# EAGLE design bluetooth_reprap2 (EAGLE 7.4.0)
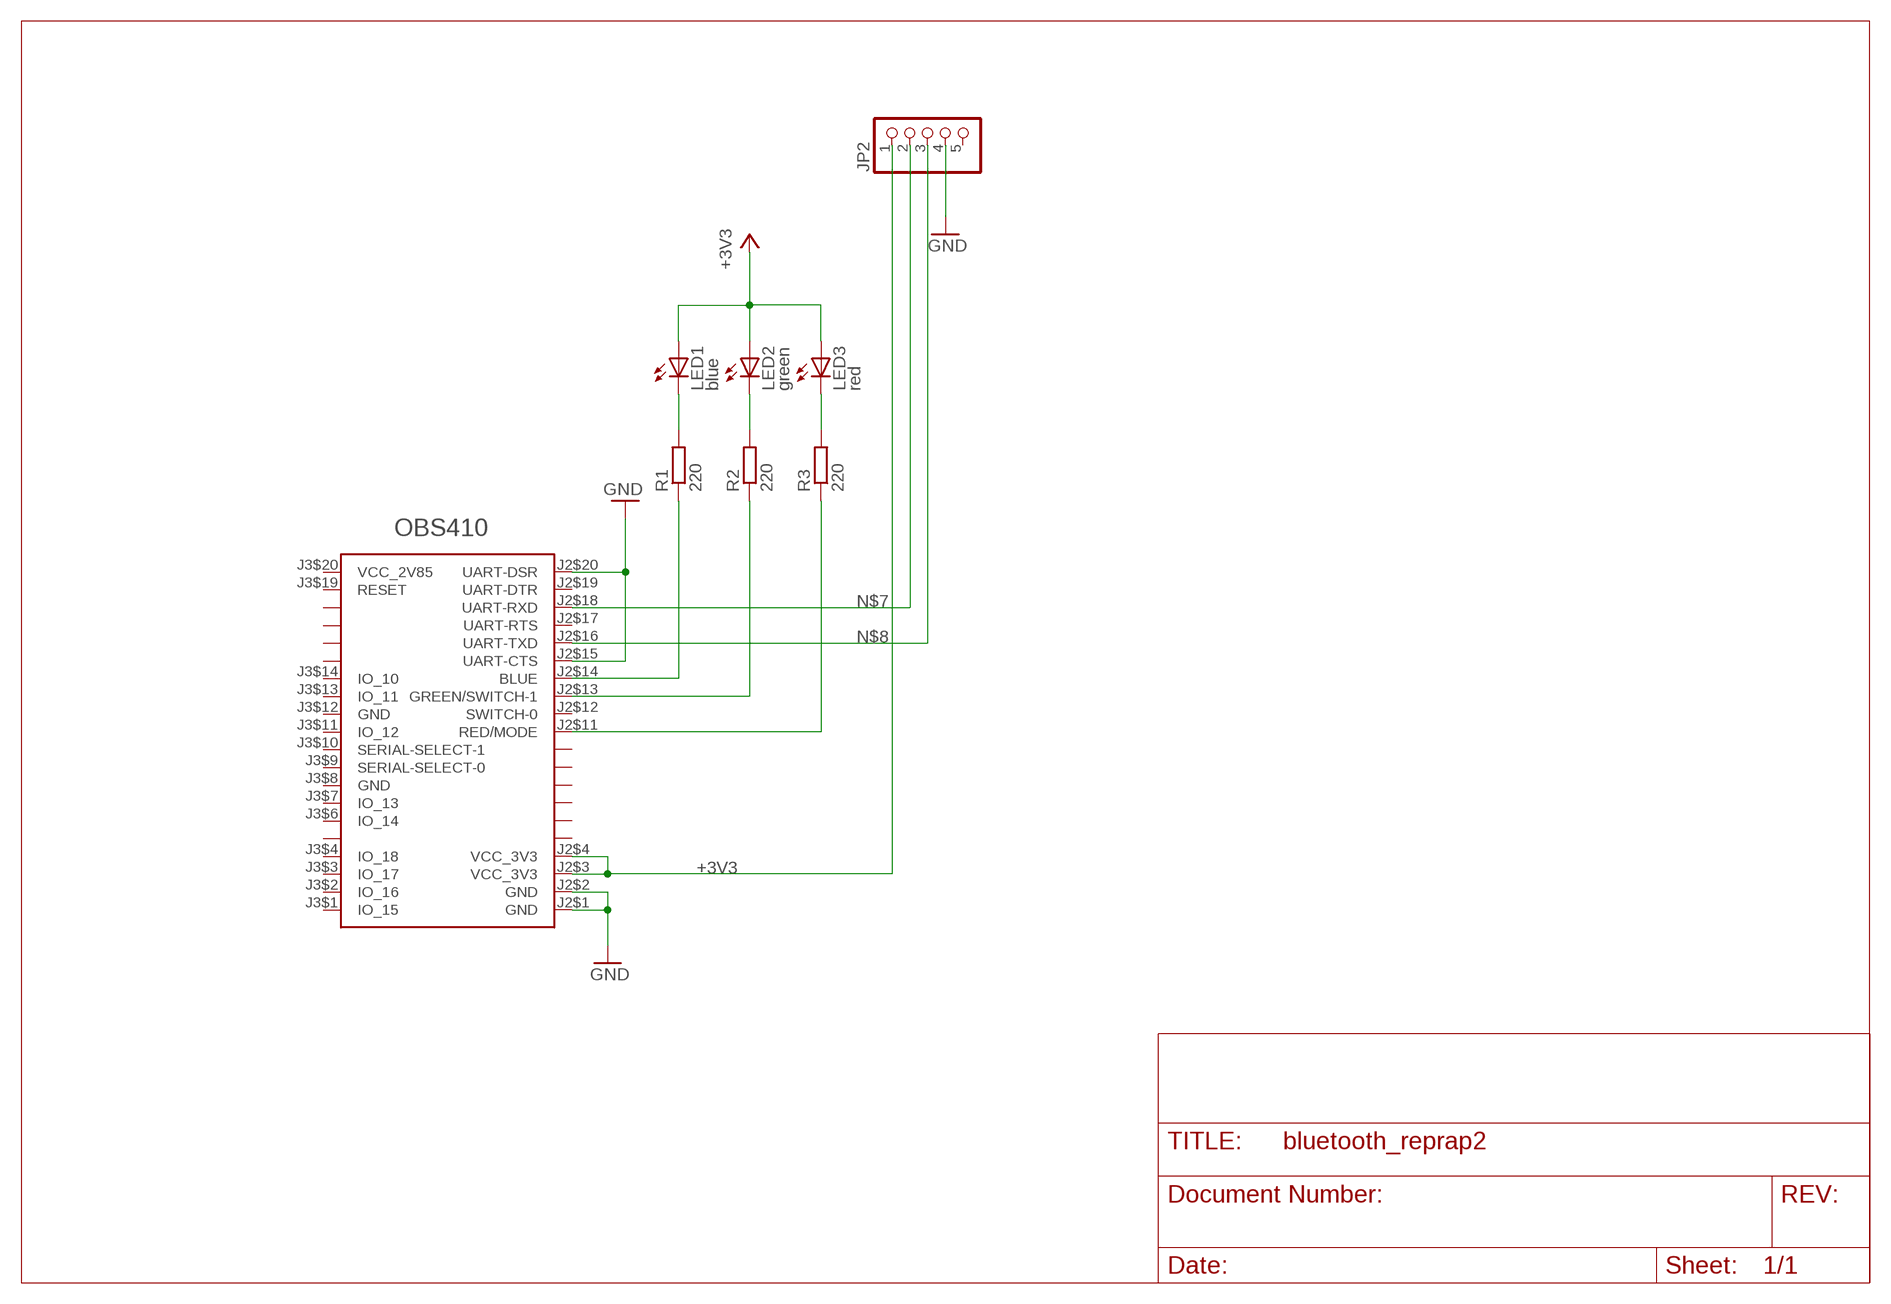
[diagram p0: schematic, sheet 1]

## Parts
JP2  PINHD-1X5  [1X05]
LED1  blue  LED5MM  [LED5MM]
LED2  green  LED5MM  [LED5MM]
LED3  red  LED5MM  [LED5MM]
R1  220  R-EU_0207/10  [0207/10]
R2  220  R-EU_0207/10  [0207/10]
R3  220  R-EU_0207/10  [0207/10]
U$1  OBS410  [SAMTEC-FSI-120-03-G-D-M-AB]

## Nets
+3V3: JP2.1 LED1.A LED2.A LED3.A U$1.J2$3(VCC_3V3) U$1.J2$4(VCC_3V3)
GND: JP2.4 U$1.J2$1(GND) U$1.J2$2(GND) U$1.J2$15(UART-CTS) U$1.J2$20(UART-DSR)
N$1: LED1.K(C) R1.2
N$2: LED2.K(C) R2.2
N$3: LED3.K(C) R3.2
N$4: R1.1 U$1.J2$14(BLUE)
N$5: R2.1 U$1.J2$13(GREEN/SWITCH-1)
N$6: R3.1 U$1.J2$11(RED/MODE)
N$7: JP2.2 U$1.J2$18(UART-RXD)
N$8: JP2.3 U$1.J2$16(UART-TXD)
Unconnected: JP2.5 U$1.J2$5 U$1.J2$6 U$1.J2$7 U$1.J2$8 U$1.J2$9 U$1.J2$10 U$1.J2$12(SWITCH-0) U$1.J2$17(UART-RTS) U$1.J2$19(UART-DTR) U$1.J3$1(IO_15) U$1.J3$2(IO_16) U$1.J3$3(IO_17) U$1.J3$4(IO_18) U$1.J3$5 U$1.J3$6(IO_14) U$1.J3$7(IO_13) U$1.J3$9(SERIAL-SELECT-0) U$1.J3$10(SERIAL-SELECT-1) U$1.J3$11(IO_12) U$1.J3$13(IO_11) U$1.J3$14(IO_10) U$1.J3$15 U$1.J3$16 U$1.J3$17 U$1.J3$18 U$1.J3$19(RESET) U$1.J3$20(VCC_2V85)

## Power pins joined to a net without a drawn wire
GND: U$1.J3$8(GND) U$1.J3$12(GND)

## Library data of the parts
JP2 = pinhead:PINHD-1X5: PIN HEADER
LED1-LED3 = led:LED: LED OSRAM: - CHIPLED LG R971, LG N971, LY N971, LG Q971, LY Q971, LO R971, LY R971 LH N974, LH R974 LS Q976, LO Q976, LY Q976 LO Q996 - Hyper CHIPLED LW Q18S LB Q993, LB Q99A, LB R99A - SideLED LS A670, LO A670, LY A670, LG A670, LP A670 LB A673, LV A673, LT A673, LW A673 LH A674 LY A675 LS A676, LA A676, LO A676, LY A676, LW A676 LS A679, LY A679, LG A679 - Hyper Micro SIDELED® LS Y876, LA Y876, LO Y876, LY Y876 LT Y87S - SmartLED LW L88C, LW L88S LB L89C, LB L89S, LG L890 LS L89K, LO L89K, LY L89K LS L896, LA L896, LO L896, LY L896 - TOPLED LS T670, LO T670, LY T670, LG T670, LP T670 LSG T670, LSP T670, LSY T670, LOP T670, LYG T670 LG T671, LOG T671, LSG T671 LB T673, LV T673, LT T673, LW T673 LH T674 LS T676, LA T676, LO T676, LY T676, LB T676, LH T676, LSB T676, LW T676 LB T67C, LV T67C, LT T67C, LS T67K, LO T67K, LY T67K, LW E67C LS E67B, LA E67B, LO E67B, LY E67B, LB E67C, LV E67C, LT E67C LW T67C LS T679, LY T679, LG T679 LS T770, LO T770, LY T770, LG T770, LP T770 LB T773, LV T773, LT T773, LW T773 LH T774 LS E675, LA E675, LY E675, LS T675 LS T776, LA T776, LO T776, LY T776, LB T776 LHGB T686 LT T68C, LB T68C - Hyper Mini TOPLED® LB M676 - Mini TOPLED Santana® LG M470 LS M47K, LO M47K, LY M47K Source: http://www.osram.convergy.de LUXEON: - LUMILED® LXK2-PW12-R00, LXK2-PW12-S00, LXK2-PW14-U00, LXK2-PW14-V00 LXK2-PM12-R00, LXK2-PM12-S00, LXK2-PM14-U00 LXK2-PE12-Q00, LXK2-PE12-R00, LXK2-PE12-S00, LXK2-PE14-T00, LXK2-PE14-U00 LXK2-PB12-K00, LXK2-PB12-L00, LXK2-PB12-M00, LXK2-PB14-N00, LXK2-PB14-P00, LXK2-PB14-Q00 LXK2-PR12-L00, LXK2-PR12-M00, LXK2-PR14-Q00, LXK2-PR14-R00 LXK2-PD12-Q00, LXK2-PD12-R00, LXK2-PD12-S00 LXK2-PH12-R00, LXK2-PH12-S00 LXK2-PL12-P00, LXK2-PL12-Q00, LXK2-PL12-R00 Source: www.luxeon.com KINGBRIGHT: KA-3528ASYC Source: www.kingbright.com
R1-R3 = rcl:R-EU_: RESISTOR, European symbol
U$1 = ajgl:OBS410: Bluetooth modul BlueConnect OBS410

## Board
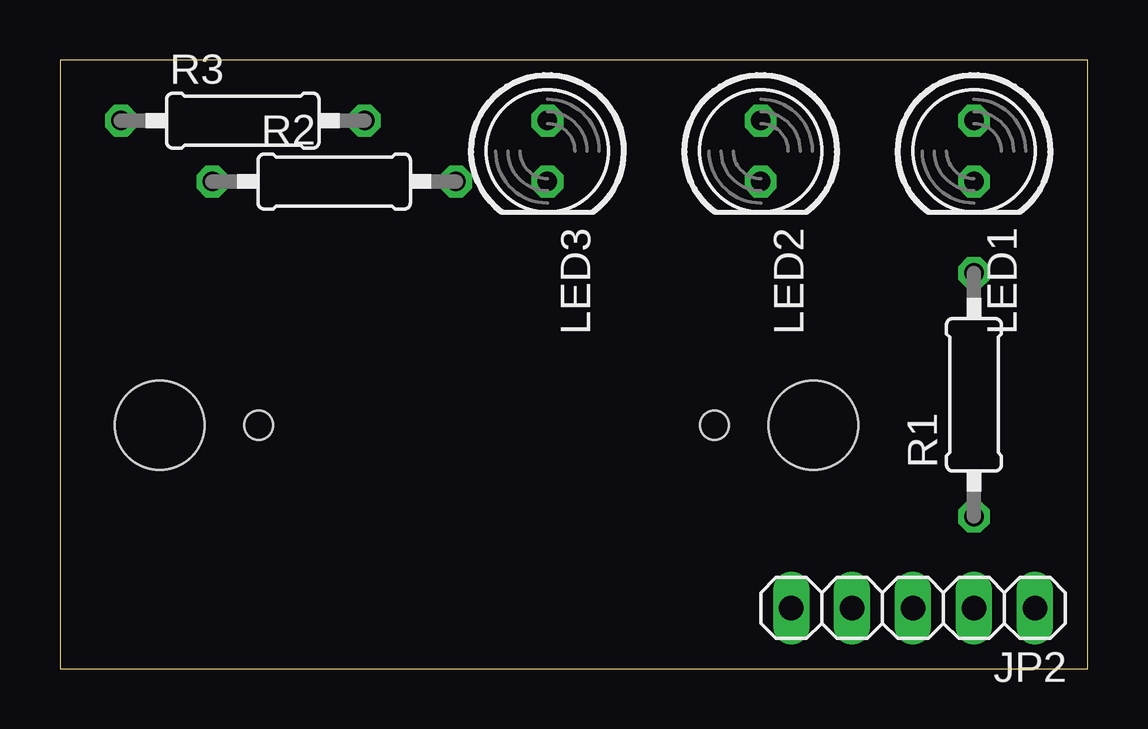
[diagram p1: board, top side]
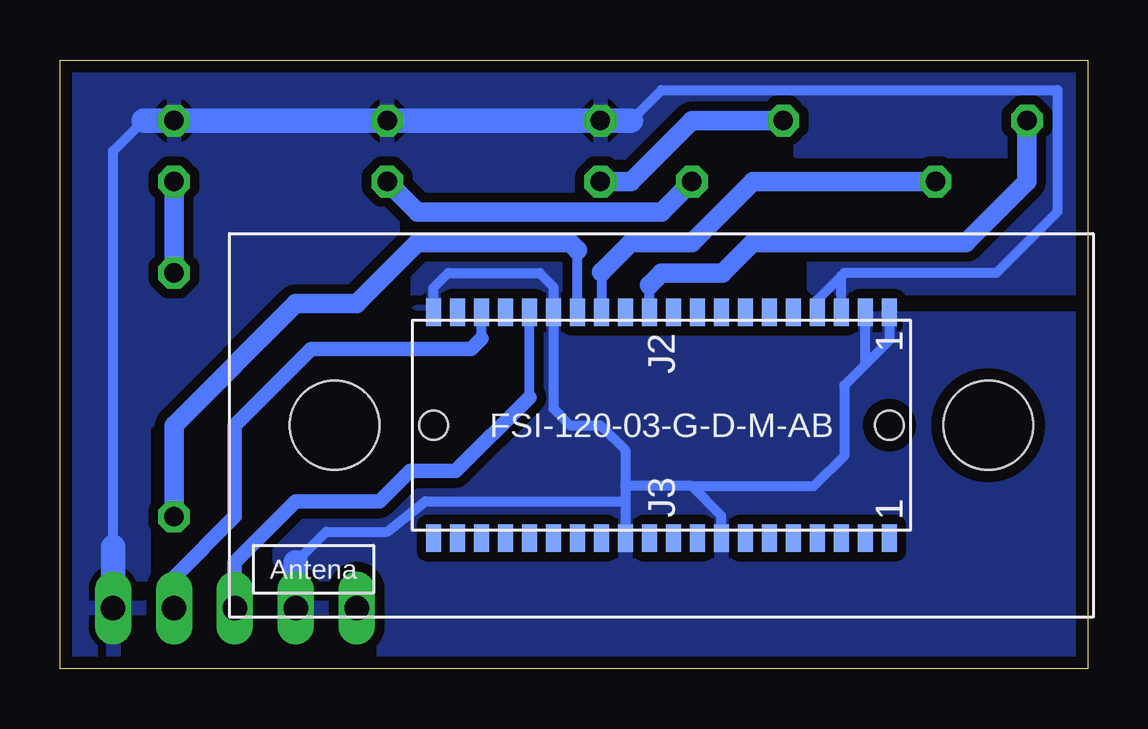
[diagram p2: board, bottom side, seen from below]

Size 42.85 x 25.39 mm. Coordinates in mm from the lower left corner, seen from the top.
Outline: 0,0 42.85,0 42.85,25.39 0,25.39 0,0
Copper layers (1*16): Top 0.035mm / dielectric 1.5mm / Bottom 0.035mm
Design rules "default *": minimum track width 10mil, minimum drill 24mil, track to track 0.4mm, track to pad 0.4mm, pad to pad 8mil, via to via 8mil, smd to smd 8mil, copper to edge 0.5mm, drill to drill 8mil, minimum pad ring 10mil, minimum via ring 8mil, stop-mask expansion 4mil, vias tented up to drill 0mil, thermal gap 10mil

### Footprints (pad centres in the part's own frame; a part is rotated, then mirrored left to right if it is on the bottom)
1X05 = drill 1.016 long: 1 -5.08,0; 2 -2.54,0; 3 0,0; 4 2.54,0; 5 5.08,0
LED5MM = drill 0.813 octagon: A -1.27,0; K 1.27,0
0207/10 = drill 0.813 octagon: 1 -5.08,0; 2 5.08,0
SAMTEC-FSI-120-03-G-D-M-AB = smd 1.14 x 0.61: J2$1 4.71,-9.5; J2$2 4.71,-8.5; J2$3 4.71,-7.5; J2$4 4.71,-6.5; J2$5 4.71,-5.5; J2$6 4.71,-4.5; J2$7 4.71,-3.5; J2$8 4.71,-2.5; J2$9 4.71,-1.5; J2$10 4.71,-0.5; J2$11 4.71,0.5; J2$12 4.71,1.5; J2$13 4.71,2.5; J2$14 4.71,3.5; J2$15 4.71,4.5; J2$16 4.71,5.5; J2$17 4.71,6.5; J2$18 4.71,7.5; J2$19 4.71,8.5; J2$20 4.71,9.5; J3$1 -4.71,-9.5; J3$2 -4.71,-8.5; J3$3 -4.71,-7.5; J3$4 -4.71,-6.5; J3$5 -4.71,-5.5; J3$6 -4.71,-4.5; J3$7 -4.71,-3.5; J3$8 -4.71,-2.5; J3$9 -4.71,-1.5; J3$10 -4.71,-0.5; J3$11 -4.71,0.5; J3$12 -4.71,1.5; J3$13 -4.71,2.5; J3$14 -4.71,3.5; J3$15 -4.71,4.5; J3$16 -4.71,5.5; J3$17 -4.71,6.5; J3$18 -4.71,7.5; J3$19 -4.71,8.5; J3$20 -4.71,9.5 | hole 3.73: 0,-13.62; 0,13.62 | hole 1.2: 0,9.5; 0,-9.5

### Placement (x,y rotation side)
JP2  35.56,2.54 180 top
LED1  38.1,21.59 270 top
LED2  29.21,21.59 270 top
LED3  20.32,21.59 270 top
R1  38.1,11.43 90 top
R2  11.43,20.32 0 top
R3  7.62,22.86 0 top
U$1  17.78,10.16 90 bottom

### Tracks (layer width: path | path; a pad name or v marks a point on that pad's centre or on a via)
+3V3
  Bottom 0.406: 40.64,5.08 40.64,21.59 39.37,22.86 | 19.05,22.86 17.78,24.13 1.27,24.13 1.27,19.05 3.81,16.51 10.16,16.51 10.28,16.39 | 10.28,16.39 11.28,15.39 U$1.J2$4 | U$1.J2$3 10.28,16.39
  Bottom 1.016: JP2.1 40.64,5.08 | 39.37,22.86 LED3.A 19.05,22.86
  pour Bottom: 39.37,0 42.86,0 42.86,25.4 0,25.4 0,15.88 11.43,15.88 11.43,17.78 5.08,17.78 2.54,20.32 2.54,21.59 12.06,21.59 12.06,22.86 16.51,22.86 20.32,19.05 24.13,19.05 30.48,15.24 33.02,15.24 39.37,10.16
GND
  Bottom 0.406: U$1.J2$20 27.28,15.9 26.67,16.51 22.86,16.51 22.28,15.93 U$1.J2$15 22.28,10.85 21.59,10.16 20.32,10.16 19.28,9.12 19.28,7.62 | 19.28,7.62 19.28,6.99 | 19.28,6.99 U$1.J3$12 | U$1.J3$8 15.28,6.39 16.51,7.62 | 16.51,7.62 19.28,7.62 | 16.51,7.62 11.43,7.62 10.16,8.89 10.16,11.82 9.28,12.7 | 9.28,12.7 U$1.J2$2 | U$1.J2$1 8.28,13.7 9.28,12.7 | 33.02,4.45 31.75,5.71 29.21,5.71 27.62,6.99 19.28,6.99
  Bottom 1.016: JP2.4 33.02,4.45
  pour Bottom: 31.11,0 33.66,4.45 34.29,6.99 29.21,6.99 27.94,8.26 26.67,8.26 23.5,11.43 23.5,15.24 27.94,15.24 27.94,17.78 21.59,17.78 21.59,13.97 9.53,13.97 9.53,14.61 0,14.61 0,0
N$1
  Bottom 0.813: LED1.K R1.2
N$2
  Bottom 0.813: LED2.K 27.94,19.05 17.78,19.05 R2.2
N$3
  Bottom 0.813: LED3.K 19.05,20.32 16.51,22.86 R3.2
N$4
  Bottom 0.406: U$1.J2$14 21.28,17.47
  Bottom 0.813: 21.28,17.47 21.59,17.78 27.94,17.78 30.48,15.24 33.02,15.24 38.1,10.16 R1.1
N$5
  Bottom 0.406: 20.28,16.55 U$1.J2$13
  Bottom 0.813: R2.1 13.97,20.32 16.51,17.78 19.05,17.78 20.28,16.55
N$6
  Bottom 0.406: U$1.J2$11 18.28,16.01
  Bottom 0.813: R3.1 2.54,20.32 5.08,17.78 13.97,17.78 15.24,16.51 17.78,16.51 18.28,16.01
N$7
  Bottom 0.406: 25.28,13.77 U$1.J2$18
  Bottom 0.61: JP2.2 38.1,3.81 35.56,6.35 35.56,10.16 32.38,13.34 25.72,13.34 25.28,13.77
N$8
  Bottom 0.406: 23.28,11.33 U$1.J2$16
  Bottom 0.61: JP2.3 35.56,4.45 33.02,6.99 29.53,6.99 28.26,8.26 26.35,8.26 23.28,11.33